# Altium schematic sheet cw312_xc7a35t_fpga_pwr.SchDoc: Power Rails
size Letter; Organization: NewAE Technology Inc.; Address1: 127 Joseph Zatzman Dr; Address2: Dartmouth; Address3: NS; Address4: Canada B3B 1W1; DocumentNumber: .; Revision: .; SheetNumber: 2; SheetTotal: 4; SheetApproved: YES
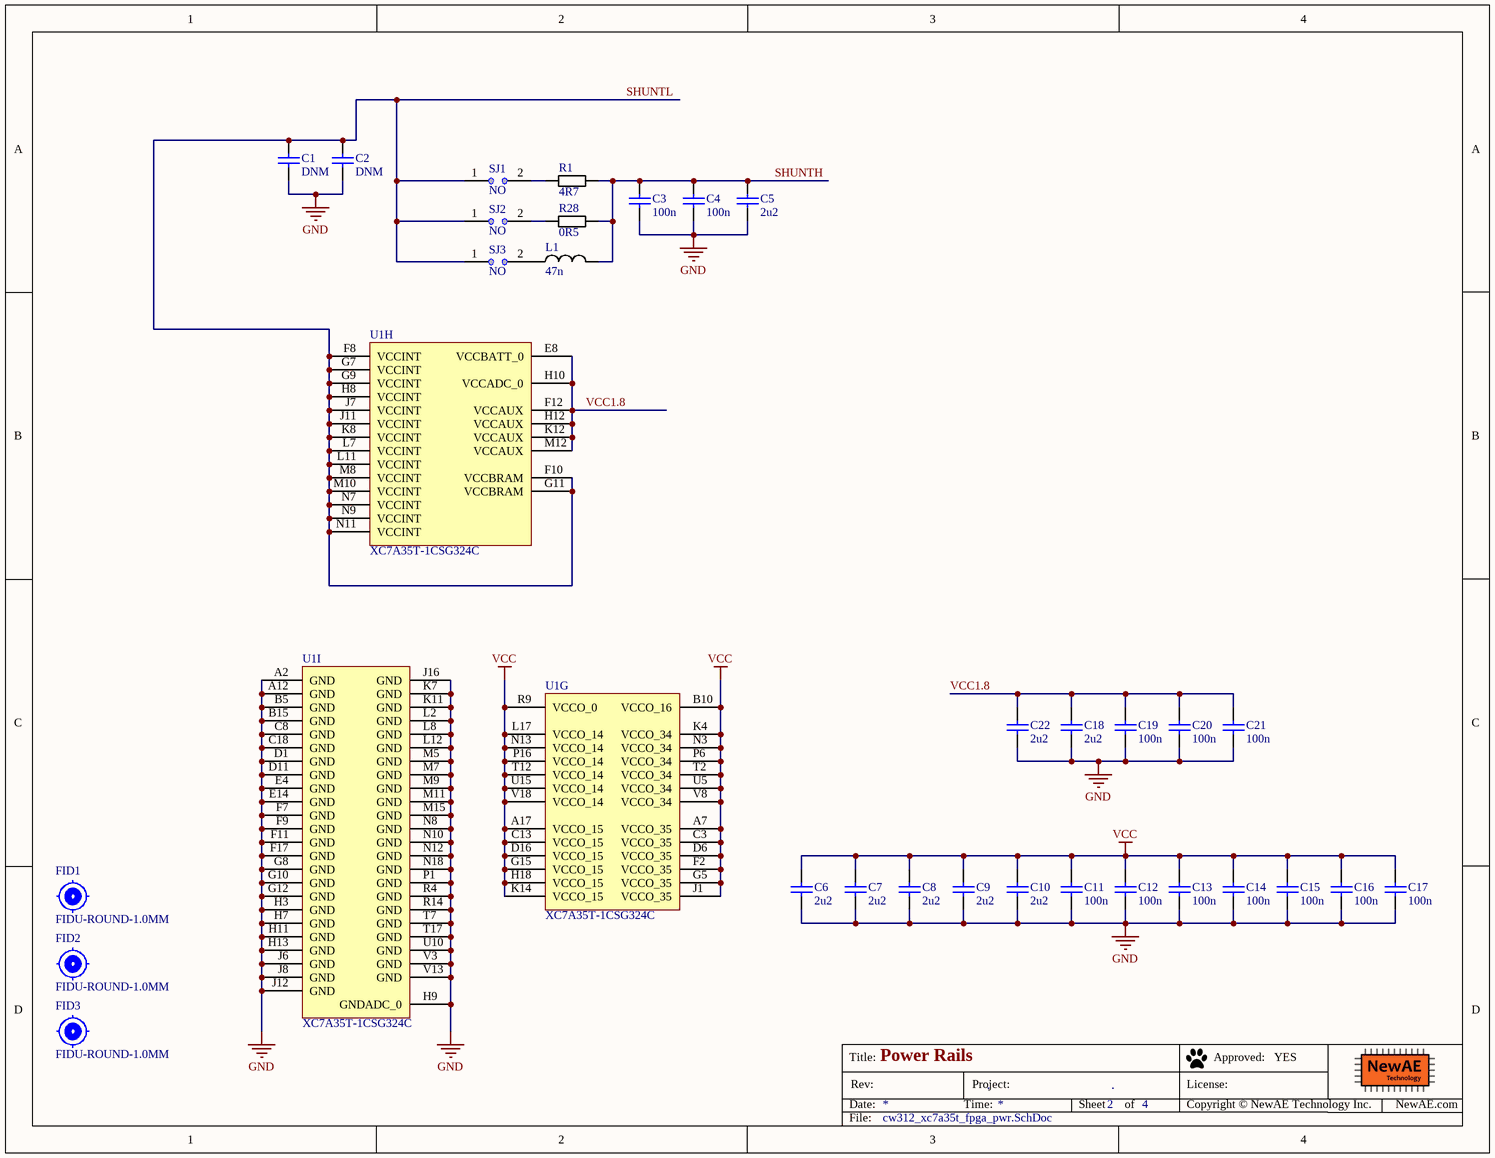
[diagram p0: cw312_xc7a35t_fpga_pwr.SchDoc]

## Parts
C1  DNM  [CAPC0603_M]
C2  DNM  [CAPC0603_M]
C3  100n  [CAPC0603_M]
C4  100n  [CAPC0603_M]
C5  2u2  [CAPC0603_M]
C6  2u2  [CAPC0603_M]
C7  2u2  [CAPC0603_M]
C8  2u2  [CAPC0603_M]
C9  2u2  [CAPC0603_M]
C10  2u2  [CAPC0603_M]
C11  100n  [CAPC0402_M]
C12  100n  [CAPC0402_M]
C13  100n  [CAPC0402_M]
C14  100n  [CAPC0402_M]
C15  100n  [CAPC0402_M]
C16  100n  [CAPC0402_M]
C17  100n  [CAPC0402_M]
C18  2u2  [CAPC0603_M]
C19  100n  [CAPC0402_M]
C20  100n  [CAPC0402_M]
C21  100n  [CAPC0402_M]
C22  2u2  [CAPC0603_M]
FID1  FIDU-ROUND-1.0MM  [FIDU-ROUND-1.0mm]  (no BOM)
FID2  FIDU-ROUND-1.0MM  [FIDU-ROUND-1.0mm]  (no BOM)
FID3  FIDU-ROUND-1.0MM  [FIDU-ROUND-1.0mm]  (no BOM)
L1  47n  [IND_0603]
R1  4R7  [RESC1608X55N]
R28  0R5  [RESC1608X55N]
SJ1  NO  [SJ_2S_NO]  (no BOM)
SJ2  NO  [SJ_2S_NO]  (no BOM)
SJ3  NO  [SJ_2S_NO]  (no BOM)
U1  XC7A35T-1CSG324C  [CSG324]  (parts G,H,I of 9)

## Nets
GND: C1.2 C2.2 C3.2 C4.2 C5.2 C6.2 C7.2 C8.2 C9.2 C10.2 C11.2 C12.2 C13.2 C14.2 C15.2 C16.2 C17.2 C18.2 C19.2 C20.2 C21.2 C22.2 U1.A2(GND) U1.A12(GND) U1.B5(GND) U1.B15(GND) U1.C8(GND) U1.C18(GND) U1.D1(GND) U1.D11(GND) U1.E4(GND) U1.E14(GND) U1.F7(GND) U1.F9(GND) U1.F11(GND) U1.F17(GND) U1.G8(GND) U1.G10(GND) U1.G12(GND) U1.H3(GND) U1.H7(GND) U1.H9(GNDADC_0) U1.H11(GND) U1.H13(GND) U1.J6(GND) U1.J8(GND) U1.J12(GND) U1.J16(GND) U1.K7(GND) U1.K11(GND) U1.L2(GND) U1.L8(GND) U1.L12(GND) U1.M5(GND) U1.M7(GND) U1.M9(GND) U1.M11(GND) U1.M15(GND) U1.N8(GND) U1.N10(GND) U1.N12(GND) U1.N18(GND) U1.P1(GND) U1.R4(GND) U1.R14(GND) U1.T7(GND) U1.T17(GND) U1.U10(GND) U1.V3(GND) U1.V13(GND)
VCC: C6.1 C7.1 C8.1 C9.1 C10.1 C11.1 C12.1 C13.1 C14.1 C15.1 C16.1 C17.1 U1.A7(VCCO_35) U1.A17(VCCO_15) U1.B10(VCCO_16) U1.C3(VCCO_35) U1.C13(VCCO_15) U1.D6(VCCO_35) U1.D16(VCCO_15) U1.F2(VCCO_35) U1.G5(VCCO_35) U1.G15(VCCO_15) U1.H18(VCCO_15) U1.J1(VCCO_35) U1.K4(VCCO_34) U1.K14(VCCO_15) U1.L17(VCCO_14) U1.N3(VCCO_34) U1.N13(VCCO_14) U1.P6(VCCO_34) U1.P16(VCCO_14) U1.R9(VCCO_0) U1.T2(VCCO_34) U1.T12(VCCO_14) U1.U5(VCCO_34) U1.U15(VCCO_14) U1.V8(VCCO_34) U1.V18(VCCO_14)
SHUNTH: C3.1 C4.1 C5.1 L1.2 R1.2 R28.2
SHUNTL: C1.1 C2.1 SJ1.1 SJ2.1 SJ3.1 U1.F8(VCCINT) U1.F10(VCCBRAM) U1.G7(VCCINT) U1.G9(VCCINT) U1.G11(VCCBRAM) U1.H8(VCCINT) U1.J7(VCCINT) U1.J11(VCCINT) U1.K8(VCCINT) U1.L7(VCCINT) U1.L11(VCCINT) U1.M8(VCCINT) U1.M10(VCCINT) U1.N7(VCCINT) U1.N9(VCCINT) U1.N11(VCCINT)
VCC1.8: C18.1 C19.1 C20.1 C21.1 C22.1 U1.E8(VCCBATT_0) U1.F12(VCCAUX) U1.H10(VCCADC_0) U1.H12(VCCAUX) U1.K12(VCCAUX) U1.M12(VCCAUX)
NetL1_1: L1.1 SJ3.2
NetR1_1: R1.1 SJ1.2
NetR28_1: R28.1 SJ2.2

## Notes on the sheet
- Title:
- Date:
- Rev:
- Time:
- Project:
- Sheet
- of
- License:
- Copyright © NewAE Technology Inc.
- Approved:
- NewAE.com
- File:

## Library data of the parts
C1 C2 = CCHIP-100n-0603: Manufacture 1: Kemet; Manufacture Part Number 1: C0603C104K5RACTU; Component Group: Capacitor; Value: 100n; Case-EIA: 0603; Case-Metric: 1608; Rated Voltage: 50VDC; Part Number: CCHIP-100n-0603; Footprint: 0603; Pin Count: 2; Supplier 1: Digi-Key; Supplier Part Number 1: 399-5089-2-ND; Mounting Technology: SMT; Component Kind: Standard; Component Type: Standard
C3 C4 = CCHIP-100n-0603: 100n, 0603; Manufacture 1: Kemet; Manufacture Part Number 1: C0603C104K5RACTU; Component Group: Capacitor; Case-EIA: 0603; Case-Metric: 1608; Rated Voltage: 50VDC; Part Number: CCHIP-100n-0603; Footprint: 0603; Pin Count: 2; Supplier 1: Digi-Key; Supplier Part Number 1: 399-5089-2-ND; Value: 100n; Mounting Technology: SMT; Component Kind: Standard; Component Type: Standard
C5-C10 C18 C22 = CCHIP-2u2-0603: 2u2, 0603; Manufacture 1: Samsung; Manufacture Part Number 1: CL10B225KP8NNNC; Component Group: Capacitor; Case-EIA: 0603; Case-Metric: 1608; Rated Voltage: 10VDC; Part Number: CCHIP-2u2-0603; Footprint: 0603; Pin Count: 2; Supplier 1: Digi-Key; Value: 2u2; Mounting Technology: SMT; Component Kind: Standard; Component Type: Standard
  C5: Supplier Part Number 1: 1276-1134-2-ND
  C6-C10 C18 C22: Supplier Part Number 1: 1276-1134-1-ND
C11-C17 C19-C21 = CCHIP-100n-0402: 100n, 0402; Manufacture Part Number 1: CGA2B3X7R1V104K050BB; Component Group: Capacitor; Case-EIA: 0402; Part Number: CCHIP-100n-0402; Footprint: 0402; Pin Count: 2; Supplier 1: Digi-Key; Supplier Part Number 1: 445-6901-1-ND; Value: 100n; Mounting Technology: SMT; Component Kind: Standard; Component Type: Standard
FID1-FID3 = FIDU-ROUND-1.0MM: ROUND FIDUCIAL; Component Group: PCB Feature; Part Number: FIDU-ROUND-1.0MM; Pin Count: 0; Component Type: Standard (No BOM)
L1 = LCHIP-47N-0603: FIXED IND 47NH 380MA 290 MOHM; Manufacture 1: Murata Electronics North America; Manufacture Part Number 1: LQW18AN47NJ00D; Component Group: Inductor; Case-EIA: 0603; Case-Metric: 1608; Tolerance: ±5%; PP Material Stack: 0; Part Number: LCHIP-47N-0603; Footprint: 0603; Pin Count: 2; Supplier 1: Digi-Key; Supplier Part Number 1: 490-6895-1-ND; Value: 47n; Mounting Technology: SMT; Component Kind: Standard; Component Type: Standard; PP Rotation: 0
R1 = RCHIP-4R7-0603: 4R7 res, 0603, 1%, 1/10W; Manufacture 1: Yageo; Manufacture Part Number 1: RC0603FR-074R7L; Component Group: Resistor; Case-EIA: 0603; Case-Metric: 1608; Rated Power: 0.1W; Rated Voltage: 75VDC; Part Number: RCHIP-4R7-0603; Footprint: 0603; Pin Count: 2; Supplier 1: Digi-Key; Supplier Part Number 1: YAG3371CT-ND; Value: 4R7; Tolerance: 1%; Mounting Technology: SMT; Temperature Range: -55C to 155C; Component Kind: Standard; Component Type: Standard
R28 = RCHIP-0R500-0603: 0R500 res, 0603, 1%, 1/10W; Manufacture 1: Yageo; Manufacture Part Number 1: RL0603FR-070R5L; Component Group: Resistor; Case-EIA: 0603; Case-Metric: 1608; Rated Power: 0.1W; Rated Voltage: 75VDC; Part Number: RCHIP-0R500-0603; Footprint: 0603; Pin Count: 2; Supplier 1: Digi-Key; Supplier Part Number 1: 311-.5QCT-ND; Value: 0R5; Tolerance: 1%; Mounting Technology: SMT; Temperature Range: -55C to 155C; Component Kind: Standard; Component Type: Standard
SJ1-SJ3 = SJ_2S_NO: Solder Jumper, NO; Component Group: PCB Feature; Part Number: SJ_2S_NO; Pin Count: 2; Mounting Technology: COPPER; Component Type: Standard (No BOM)
U1 = CMP-0383-00012-1: Artix-7 FPGA, 210 User I/Os, 0 GTP, 324-Ball BGA, Speed Grade 1, Commercial Grade, Pb-Free; Manufacturer: Xilinx; GTP: 0; Available User I/O: 210; Speed Grades: 1; Logic Cells: 33280; Total Block RAM: 1800 Kb; CMTs: 5; Maximum Distributed RAM: 400 Kb; ComponentLink2URL: http://www.xilinx.com/support/documentation/data_sheets/ds180_7Series_Overview.pdf; ComponentLink2Description: Datasheet; DatasheetVersion: Rev. 1.15; PackageDescription: 324-Ball Wire-Bond Chip-Scale BGA, Body 15 x 15 mm, Pitch 0.8 mm; ComponentLink4URL: http://www.xilinx.com/support/documentation/user_guides/ug475_7Series_Pkg_Pinout.pdf; PackageReference: CSG-324; Mounting Technology: Surface Mount; PackageVersion: Rev. 1.11; ComponentLink1Description: Manufacturer URL; ComponentLink3Description: Pinout; ComponentLink1URL: http://www.xilinx.com/; ComponentLink3URL: http://www.xilinx.com/support/documentation/user_guides/ug475_7Series_Pkg_Pinout.pdf; PartNumber: XC7A35T-1CSG324C; ComponentLink4Description: Package Specification; Operating Temperature Range: Commercial